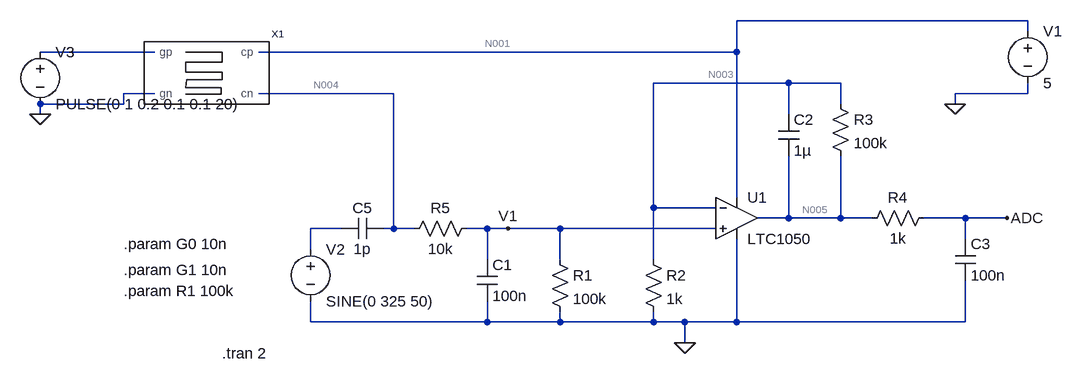
[diagram p0: schematic Draft1.asc]
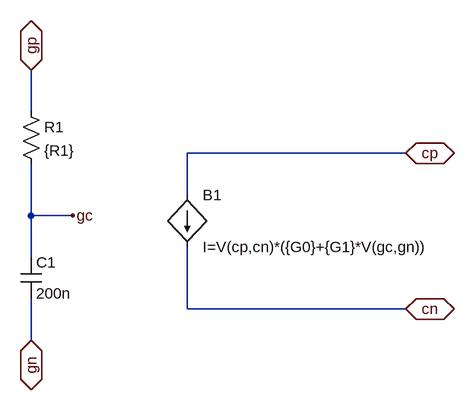
[diagram p1: sub-circuit gassensor_paul.asc]
Draft1.asc, the LTspice schematic file:
Version 4
SHEET 1 1688 680
WIRE 928 -48 480 -48
WIRE 928 -32 928 -48
WIRE -416 0 -592 0
WIRE 480 0 480 -48
WIRE 480 0 -256 0
WIRE 560 48 352 48
WIRE 640 48 560 48
WIRE -416 64 -464 64
WIRE -48 64 -256 64
WIRE 928 64 928 48
WIRE 928 64 816 64
WIRE -464 80 -464 64
WIRE -464 80 -592 80
WIRE 640 80 640 48
WIRE 816 80 816 64
WIRE -592 96 -592 80
WIRE 560 96 560 48
WIRE 480 224 480 0
WIRE 352 240 352 48
WIRE 448 240 352 240
WIRE 560 256 560 160
WIRE 560 256 512 256
WIRE 640 256 640 160
WIRE 640 256 560 256
WIRE 688 256 640 256
WIRE 832 256 768 256
WIRE 896 256 832 256
WIRE -128 272 -176 272
WIRE -48 272 -48 64
WIRE -48 272 -64 272
WIRE -16 272 -48 272
WIRE 96 272 64 272
WIRE 128 272 96 272
WIRE 208 272 128 272
WIRE 448 272 208 272
WIRE 832 288 832 256
WIRE -176 304 -176 272
WIRE 96 320 96 272
WIRE 208 320 208 272
WIRE 352 320 352 240
WIRE -176 416 -176 384
WIRE 96 416 96 384
WIRE 96 416 -176 416
WIRE 208 416 208 400
WIRE 208 416 96 416
WIRE 352 416 352 400
WIRE 352 416 208 416
WIRE 400 416 352 416
WIRE 480 416 480 288
WIRE 480 416 400 416
WIRE 832 416 832 352
WIRE 832 416 480 416
WIRE 400 448 400 416
FLAG 400 448 0
FLAG 816 80 0
FLAG 896 256 ADC
FLAG 128 272 V1
FLAG -592 96 0
SYMBOL res 80 256 R90
WINDOW 0 0 56 VBottom 2
WINDOW 3 32 56 VTop 2
SYMATTR InstName R5
SYMATTR Value 10k
SYMBOL res 192 304 R0
SYMATTR InstName R1
SYMATTR Value 100k
SYMBOL res 336 304 R0
SYMATTR InstName R2
SYMATTR Value 1k
SYMBOL res 624 64 R0
SYMATTR InstName R3
SYMATTR Value 100k
SYMBOL OpAmps\\LTC1050 480 192 R0
SYMATTR InstName U1
SYMBOL cap 80 320 R0
SYMATTR InstName C1
SYMATTR Value 100n
SYMBOL cap 544 96 R0
SYMATTR InstName C2
SYMATTR Value 1µ
SYMBOL res 784 240 R90
WINDOW 0 0 56 VBottom 2
WINDOW 3 32 56 VTop 2
SYMATTR InstName R4
SYMATTR Value 1k
SYMBOL cap 816 288 R0
SYMATTR InstName C3
SYMATTR Value 100n
SYMBOL voltage 928 -48 R0
WINDOW 123 0 0 Left 0
WINDOW 39 0 0 Left 0
SYMATTR InstName V1
SYMATTR Value 5
SYMBOL cap -64 256 R90
WINDOW 0 0 32 VBottom 2
WINDOW 3 32 32 VTop 2
SYMATTR InstName C5
SYMATTR Value 1p
SYMBOL voltage -176 288 R0
WINDOW 123 0 0 Left 0
WINDOW 39 0 0 Left 0
SYMATTR InstName V2
SYMATTR Value SINE(0 325 50)
SYMBOL gasSensor_Paul -336 32 R0
SYMATTR InstName X1
SYMBOL voltage -592 -16 R0
WINDOW 123 0 0 Left 0
WINDOW 39 0 0 Left 0
SYMATTR InstName V3
SYMATTR Value PULSE(0 1 0.2 0.1 0.1 20)
TEXT -464 296 Left 2 !.param G0 10n
TEXT -464 336 Left 2 !.param G1 10n
TEXT -464 368 Left 2 !.param R1 100k
TEXT -312 464 Left 2 !.tran 2

gassensor_paul.asc, the sub-circuit schematic file:
Version 4
SHEET 1 880 680
WIRE -240 -48 -240 -112
WIRE 336 16 0 16
WIRE 0 80 0 16
WIRE -240 112 -240 32
WIRE -176 112 -240 112
WIRE -240 176 -240 112
WIRE 0 256 0 160
WIRE 336 256 0 256
WIRE -240 304 -240 240
FLAG 336 16 cp
IOPIN 336 16 BiDir
FLAG 336 256 cn
IOPIN 336 256 BiDir
FLAG -176 112 gc
FLAG -240 -112 gp
IOPIN -240 -112 BiDir
FLAG -240 304 gn
IOPIN -240 304 BiDir
SYMBOL bi 0 80 R0
SYMATTR InstName B1
SYMATTR Value I=V(cp,cn)*({G0}+{G1}*V(gc,gn))
SYMBOL res -256 -64 R0
SYMATTR InstName R1
SYMATTR Value {R1}
SYMBOL cap -256 176 R0
SYMATTR InstName C1
SYMATTR Value 200n

The netlist it stands for:
* Draft1.asc
R5 V1 N004 10k
R1 V1 0 100k
R2 N003 0 1k
R3 N003 N005 100k
XU1 V1 N003 N001 0 N005 LTC1050  ; pins In+ In- V+ V- OUT
C1 V1 0 100n
C2 N003 N005 1µ
R4 ADC N005 1k
C3 ADC 0 100n
V1 N001 0 5
C5 N004 N006 1p
V2 N006 0 SINE(0 325 50)
XX1 N001 N004 N002 0 gassensor_paul
V3 N002 0 PULSE(0 1 0.2 0.1 0.1 20)

* block symbol definitions
.subckt gassensor_paul cp cn gp gn
B1 cp cn I=V(cp,cn)*({G0}+{G1}*V(gc,gn))
R1 gp gc {R1}
C1 gc gn 200n
.ends gassensor_paul

.param G0 10n
.param G1 10n
.param R1 100k
.tran 2
.lib LTC.lib
.backanno
.end

* Results of the author's LTspice run, read from the files saved beside the schematic
* Operating Point, zero values left out:
*   V(v1) = 4.995 mV
*   V(n004) = 5.494 mV
*   V(n003) = 4.995 mV
*   V(n005) = 504.4 mV
*   V(n001) = 5 V
*   V(adc) = 504.4 mV
*   I(R5) = -49.95 nA
*   I(R1) = 49.95 nA
*   I(R2) = 4.995 µA
*   I(R3) = -4.995 µA
*   I(V1) = -754.2 µA
*   Ix(u1:3) = 754.1 µA
*   Ix(u1:4) = -749.1 µA
*   Ix(u1:5) = -4.995 µA
*   Ix(x1:CP) = 49.95 nA
*   Ix(x1:CN) = -49.95 nA
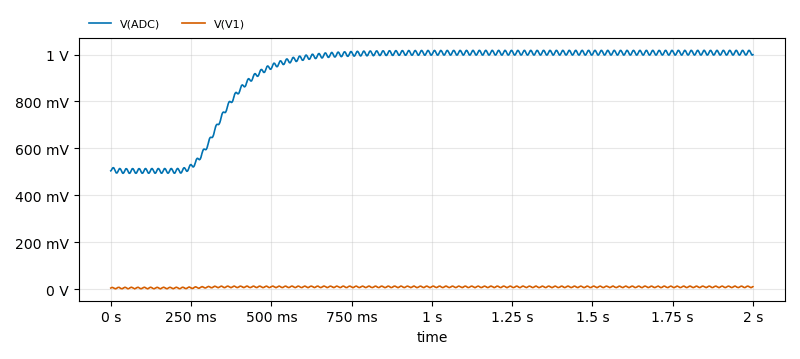
[diagram p2: Transient Analysis of Draft1.asc, plotted from the saved traces]
* Transient Analysis, 1 run:
*   V(ADC): min 493.8 mV, max 1.018 V, average 912.4 mV, rms 929.7 mV, last 999.3 mV
*   V(V1): min 1.679 mV, max 13.06 mV, average 9.276 mV, rms 9.667 mV, last 10.91 mV